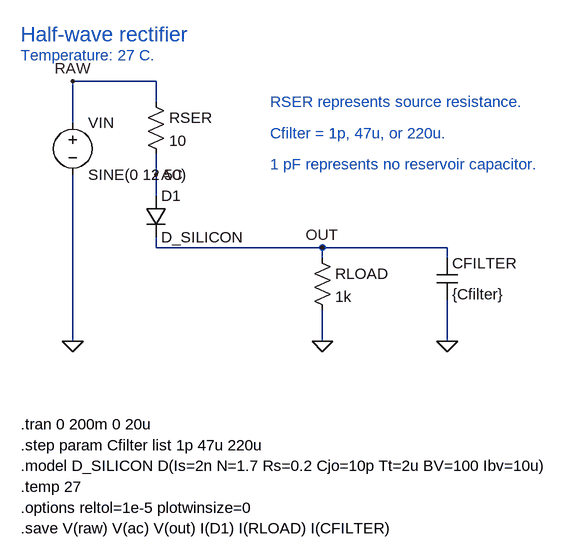
[diagram p0: schematic half-wave-rectifier.asc]
half-wave-rectifier.asc, the LTspice schematic file:
Version 4
SHEET 1 1280 1000
WIRE 128 160 128 96
WIRE 128 96 256 96
WIRE 256 96 256 128
WIRE 256 208 256 272
WIRE 256 336 256 352
WIRE 256 352 512 352
WIRE 512 352 704 352
WIRE 704 352 704 368
WIRE 512 352 512 368
WIRE 128 240 128 496
WIRE 512 448 512 496
WIRE 704 432 704 496
FLAG 128 96 RAW
FLAG 256 240 AC
FLAG 512 352 OUT
FLAG 128 496 0
FLAG 512 496 0
FLAG 704 496 0
SYMBOL voltage 128 144 R0
SYMATTR InstName VIN
SYMATTR Value SINE(0 12 50)
SYMBOL res 240 112 R0
SYMATTR InstName RSER
SYMATTR Value 10
SYMBOL diode 240 272 R0
SYMATTR InstName D1
SYMATTR Value D_SILICON
SYMBOL res 496 352 R0
SYMATTR InstName RLOAD
SYMATTR Value 1k
SYMBOL cap 688 368 R0
SYMATTR InstName CFILTER
SYMATTR Value {Cfilter}
TEXT 48 24 Left 3 ;Half-wave rectifier
TEXT 48 56 Left 2 ;Temperature: 27 C.
TEXT 432 128 Left 2 ;RSER represents source resistance.
TEXT 432 176 Left 2 ;Cfilter = 1p, 47u, or 220u.
TEXT 432 224 Left 2 ;1 pF represents no reservoir capacitor.
TEXT 48 624 Left 2 !.tran 0 200m 0 20u
TEXT 48 656 Left 2 !.step param Cfilter list 1p 47u 220u
TEXT 48 688 Left 2 !.model D_SILICON D(Is=2n N=1.7 Rs=0.2 Cjo=10p Tt=2u BV=100 Ibv=10u)
TEXT 48 720 Left 2 !.temp 27
TEXT 48 752 Left 2 !.options reltol=1e-5 plotwinsize=0
TEXT 48 784 Left 2 !.save V(raw) V(ac) V(out) I(D1) I(RLOAD) I(CFILTER)

The netlist it stands for:
* half-wave-rectifier.asc
VIN RAW 0 SINE(0 12 50)
RSER RAW AC 10
D1 AC OUT D_SILICON
RLOAD OUT 0 1k
CFILTER OUT 0 {Cfilter}
.model D D
.lib standard.dio
* Half-wave rectifier
* Temperature: 27 C.
* RSER represents source resistance.
* Cfilter = 1p, 47u, or 220u.
* 1 pF represents no reservoir capacitor.
.tran 0 200m 0 20u
.step param Cfilter list 1p 47u 220u
.model D_SILICON D(Is=2n N=1.7 Rs=0.2 Cjo=10p Tt=2u BV=100 Ibv=10u)
.temp 27
.options reltol=1e-5 plotwinsize=0
.save V(raw) V(ac) V(out) I(D1) I(RLOAD) I(CFILTER)
.backanno
.end